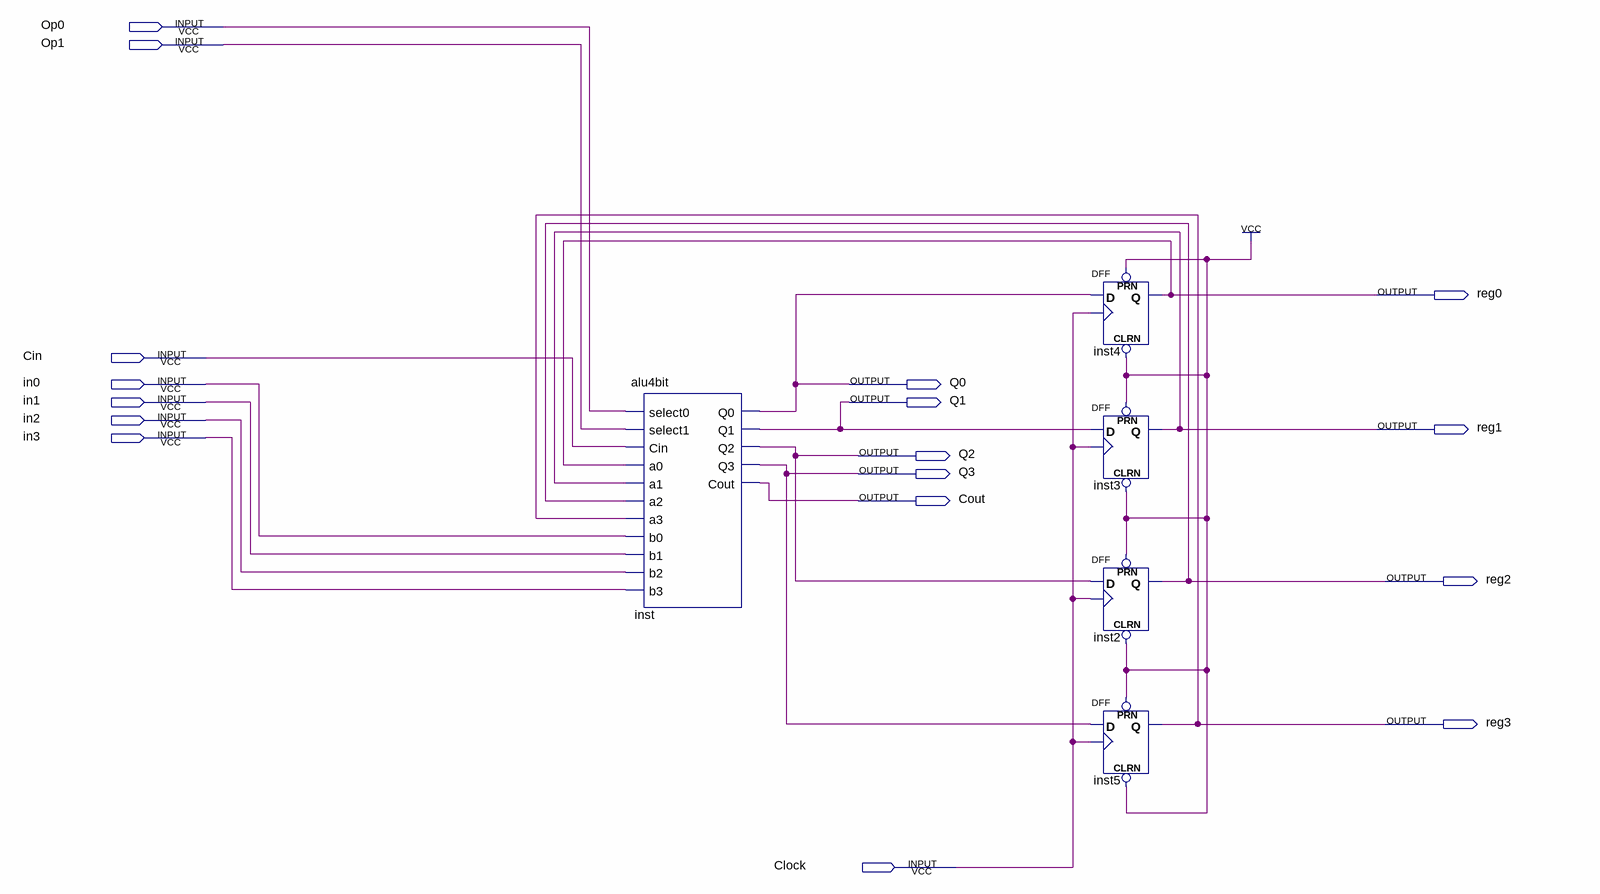
[diagram p0: schematic sheet]
// Quartus schematic system.bdf as structural Verilog: 5 symbols, 17 pins
module system (
  input  Op0,
  input  Op1,
  input  Cin,
  input  in0,
  input  in1,
  input  in2,
  input  in3,
  input  Clock,
  output reg0,
  output Q0,
  output Q1,
  output reg1,
  output Q2,
  output Q3,
  output Cout,
  output reg2,
  output reg3
);

  alu4bit inst (
    .select0(Op0), .select1(Op1), .Cin(Cin), .a0(reg0), .a1(reg1), .a2(reg2), .a3(reg3), .b0(in0), .b1(in1),
    .b2(in2), .b3(in3), .Q0(Q0), .Q1(Q1), .Q2(Q2), .Q3(Q3), .Cout(Cout));
  DFF inst4 (.CLRN(1'b1), .CLK(Clock), .D(Q0), .PRN(1'b1), .Q(reg0));
  DFF inst3 (.CLRN(1'b1), .CLK(Clock), .D(Q1), .PRN(1'b1), .Q(reg1));
  DFF inst2 (.CLRN(1'b1), .CLK(Clock), .D(Q2), .PRN(1'b1), .Q(reg2));
  DFF inst5 (.CLRN(1'b1), .CLK(Clock), .D(Q3), .PRN(1'b1), .Q(reg3));
endmodule
